# Altium schematic sheet HDLab.SchDoc
size 533 x 584 mm
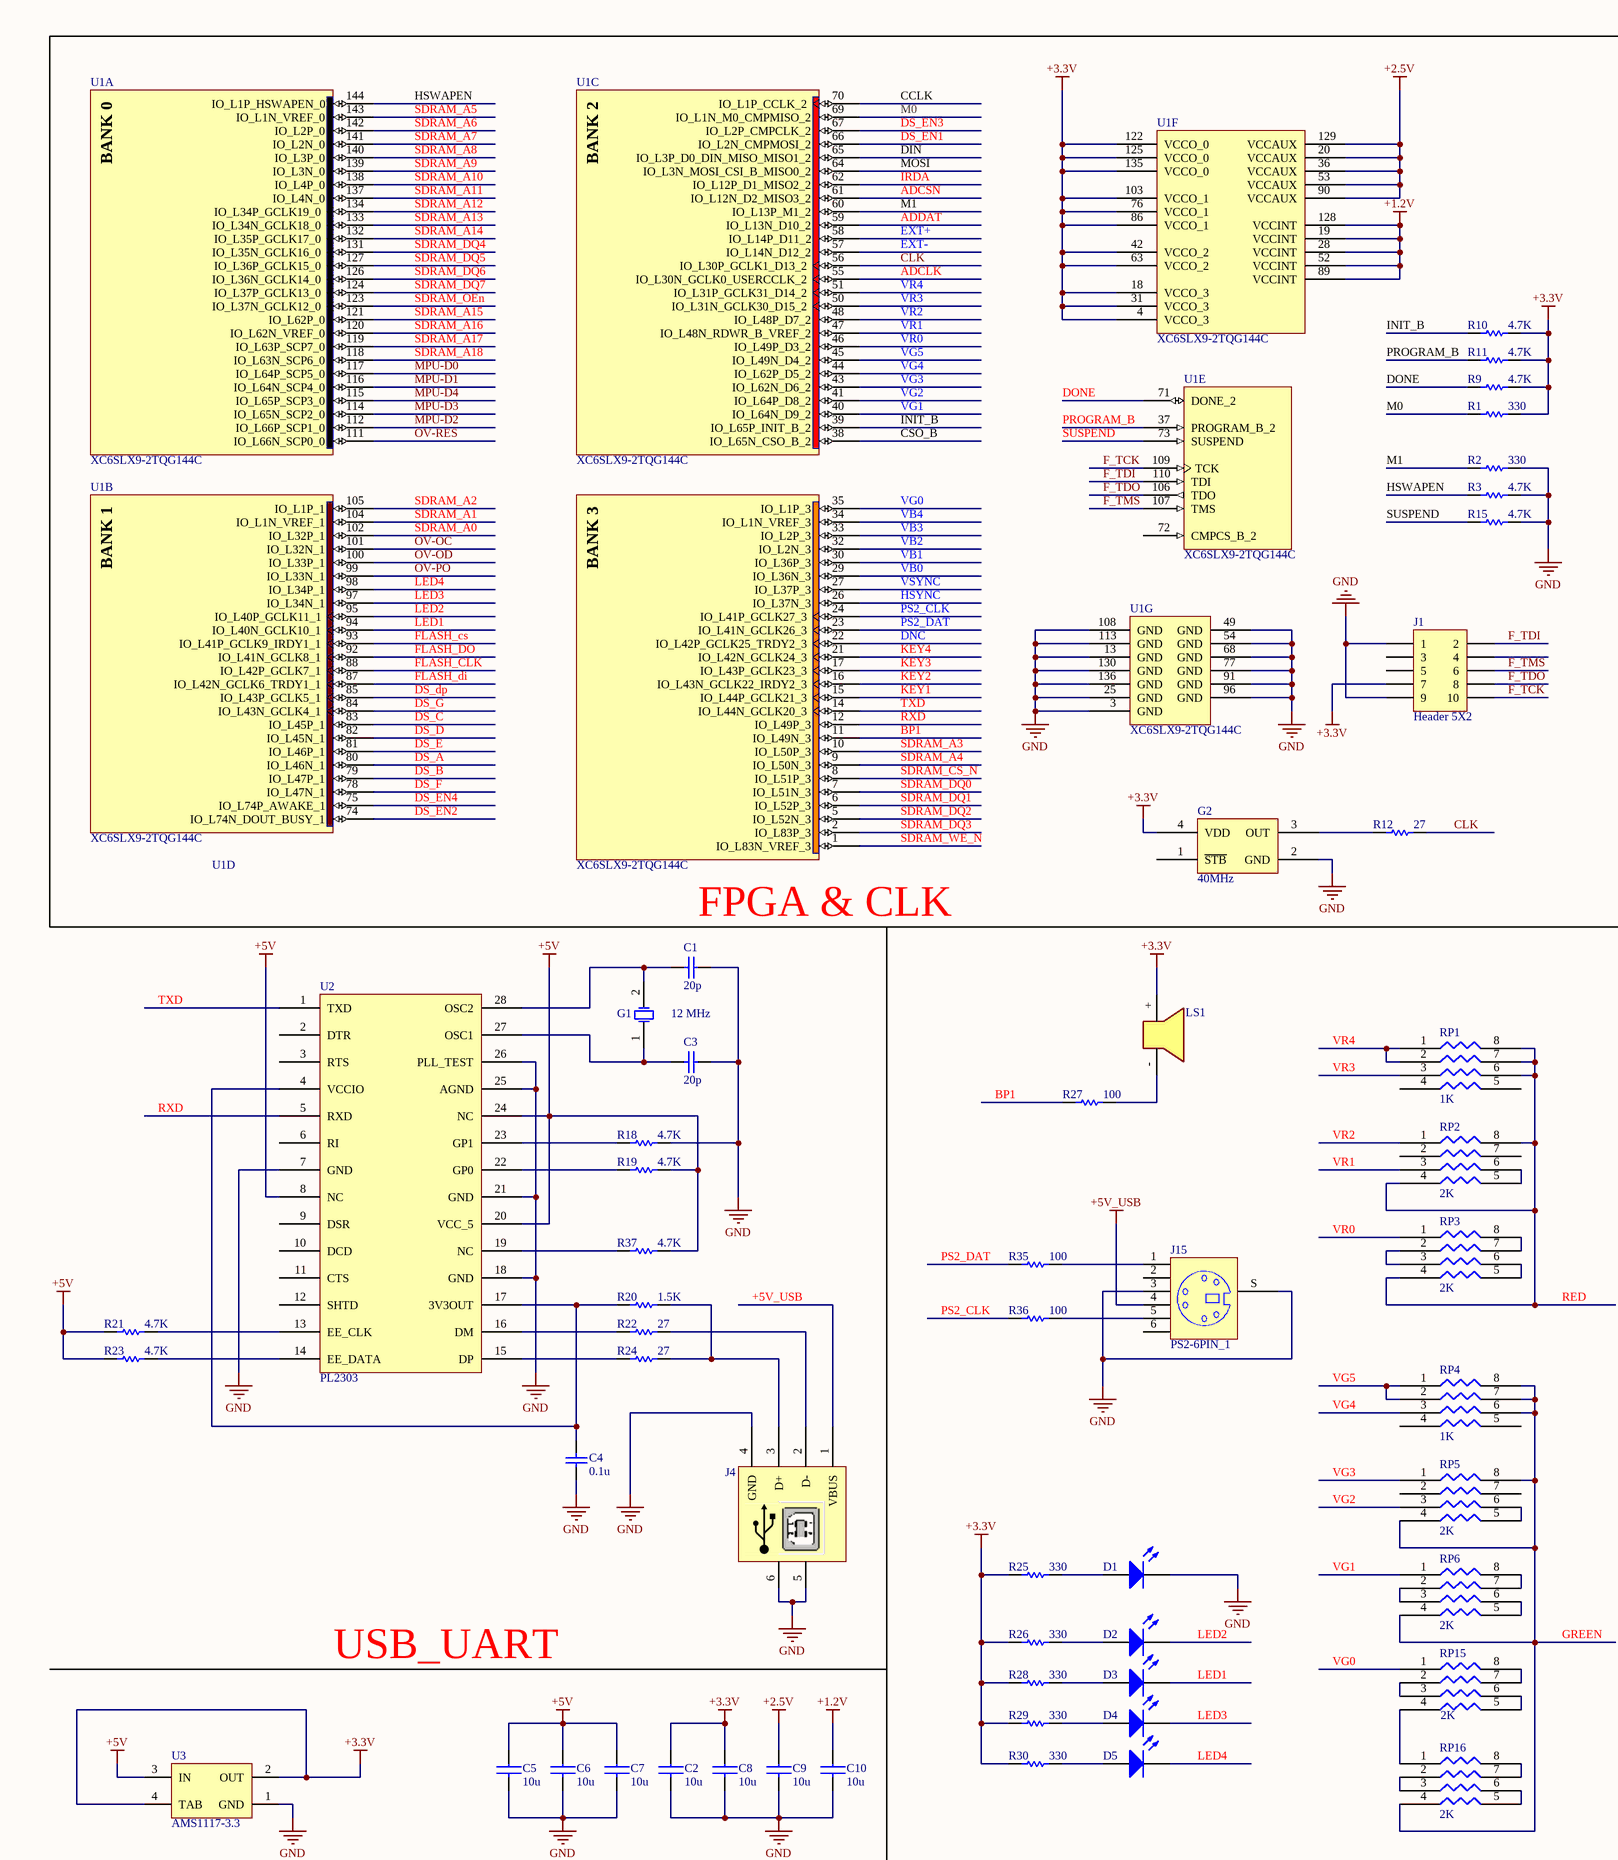
[diagram p0: HDLab.SchDoc, top left]
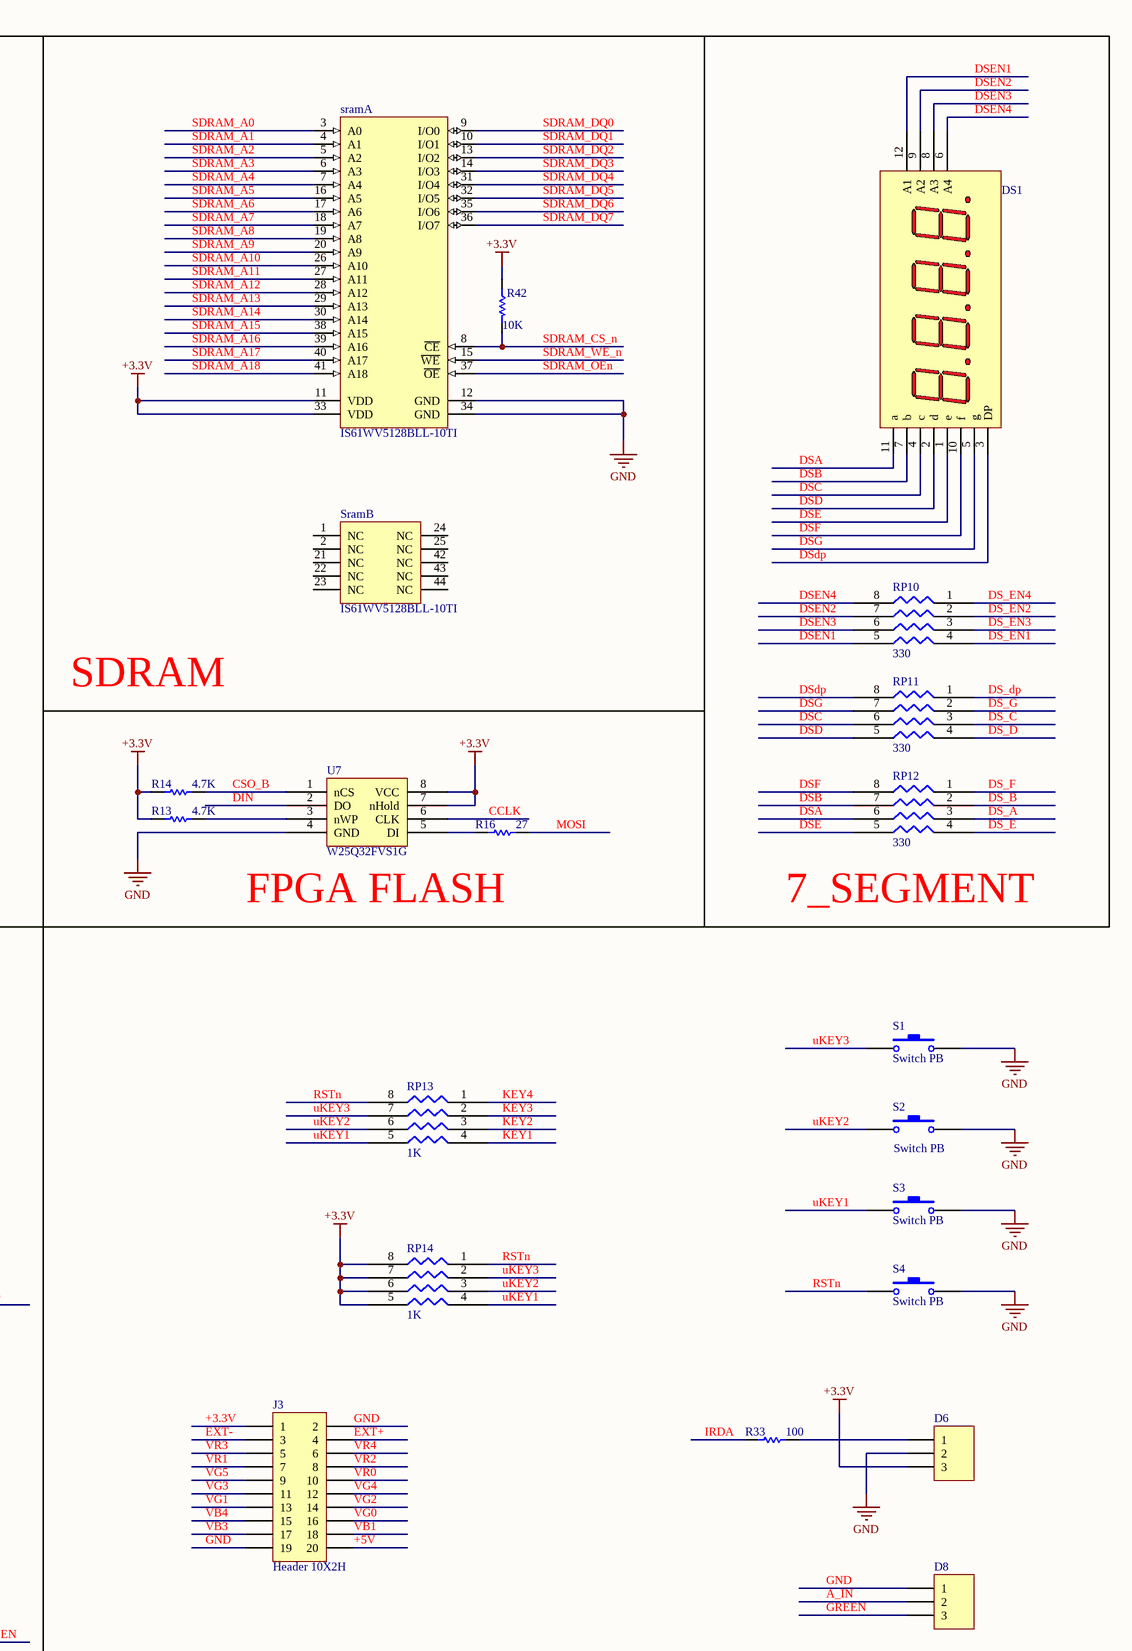
[diagram p1: HDLab.SchDoc, top right]
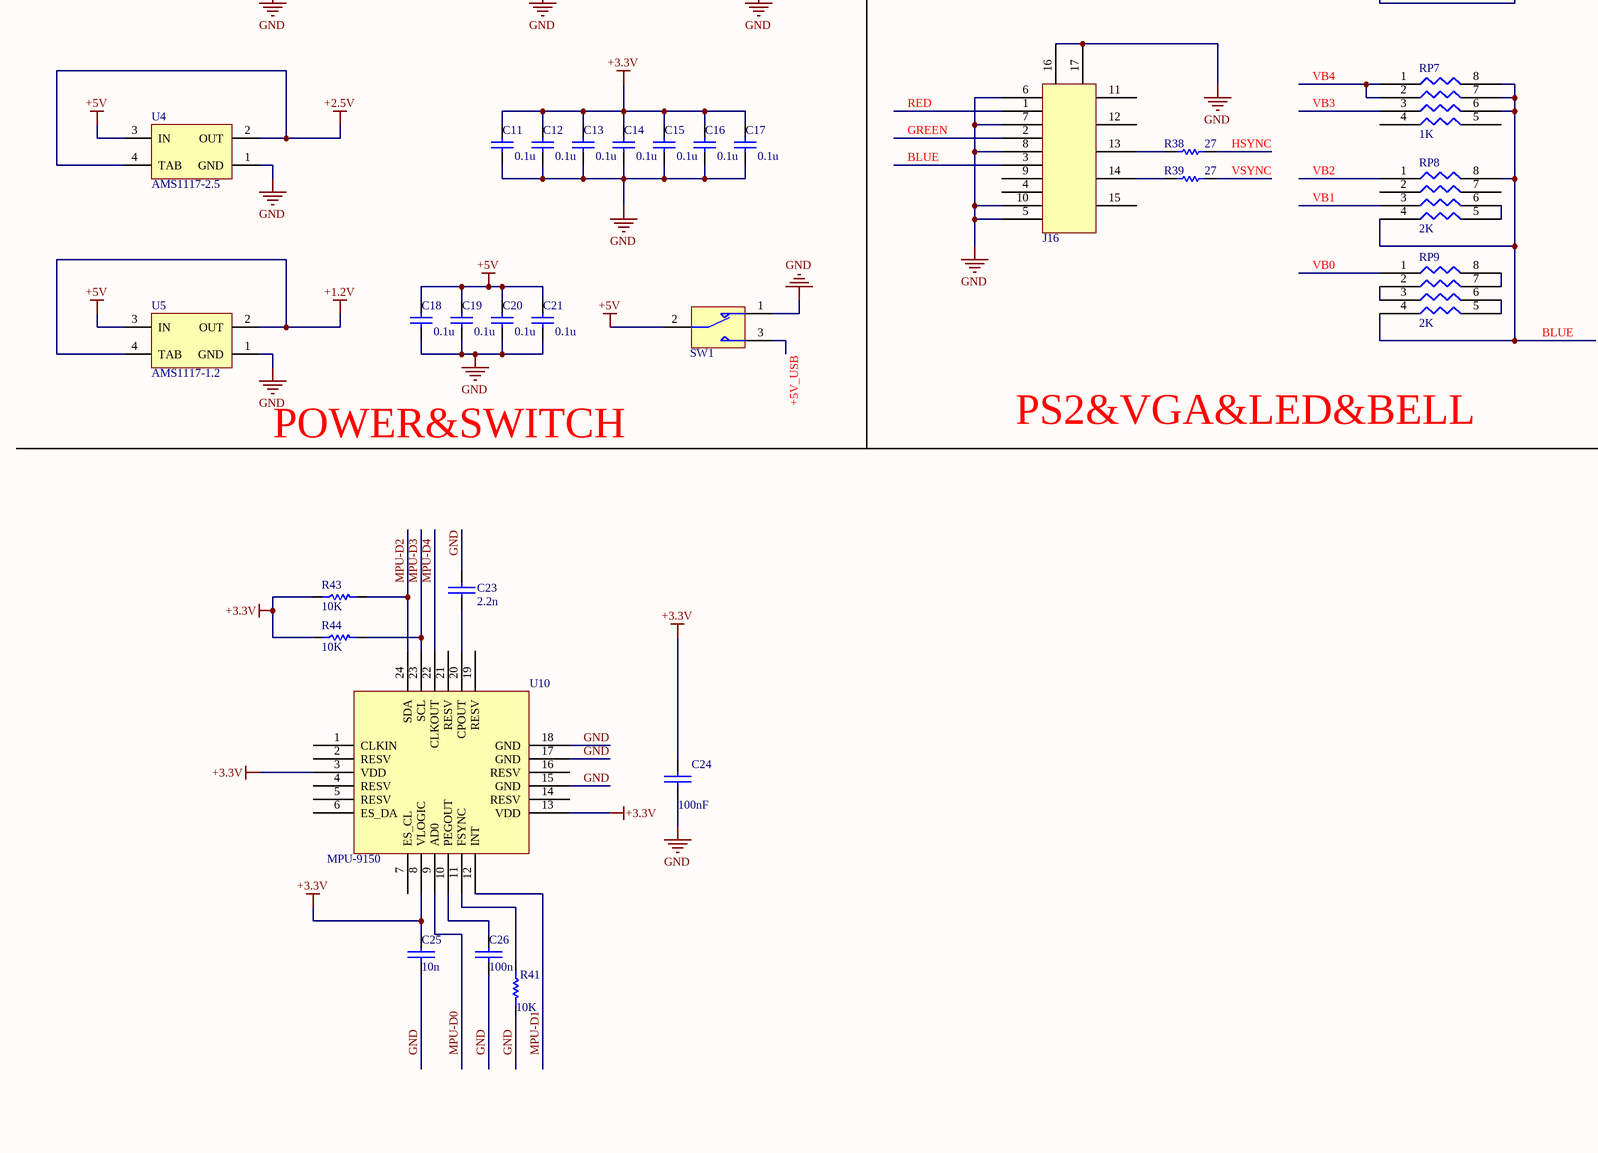
[diagram p2: HDLab.SchDoc, bottom left]
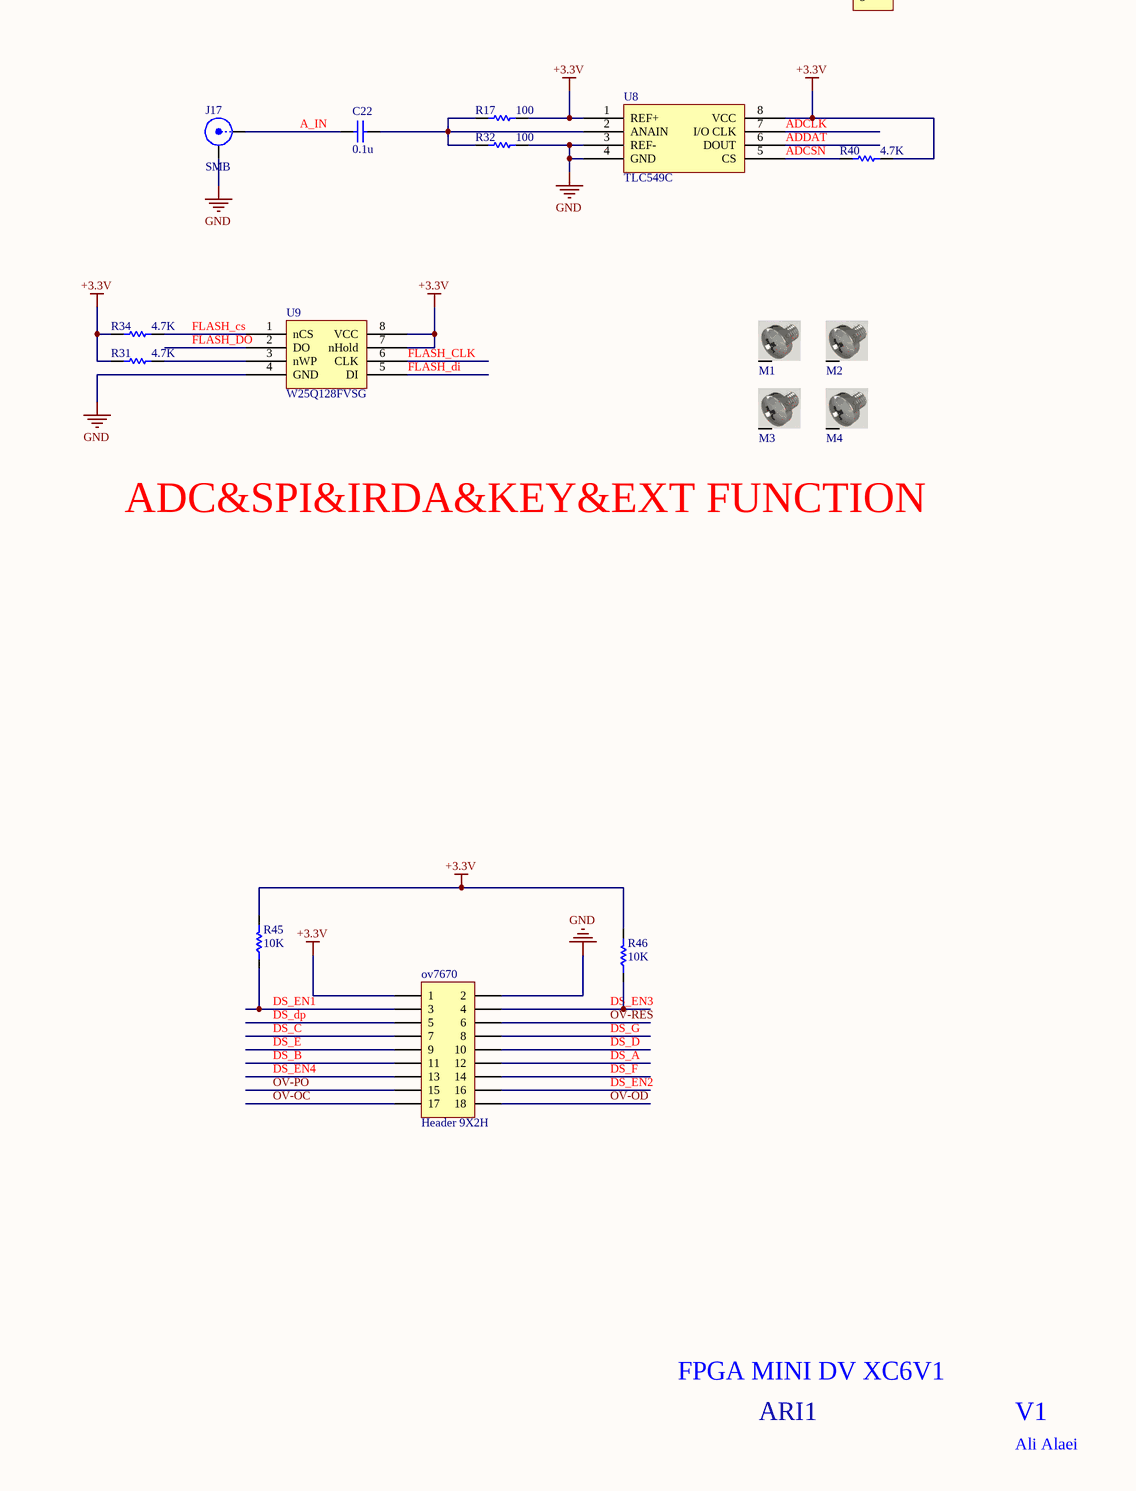
[diagram p3: HDLab.SchDoc, bottom right]

## Parts
C1  value 20p  [C0603]  (hidden comment: Cap Semi)
C2  10u  [C0805]
C3  value 20p  [C0603]  (hidden comment: Cap Semi)
C4  value 0.1u  [C0603]  (hidden comment: Cap Semi)
C5  10u  [C0805]
C6  10u  [C0805]
C7  10u  [C0805]
C8  10u  [C0805]
C9  10u  [C0805]
C10  10u  [C0805]
C11  value 0.1u  [C0603]  (hidden comment: Cap Semi)
C12  value 0.1u  [C0603]  (hidden comment: Cap Semi)
C13  value 0.1u  [C0603]  (hidden comment: Cap Semi)
C14  value 0.1u  [C0603]  (hidden comment: Cap Semi)
C15  value 0.1u  [C0603]  (hidden comment: Cap Semi)
C16  value 0.1u  [C0603]  (hidden comment: Cap Semi)
C17  value 0.1u  [C0603]  (hidden comment: Cap Semi)
C18  value 0.1u  [C0603]  (hidden comment: Cap Semi)
C19  value 0.1u  [C0603]  (hidden comment: Cap Semi)
C20  value 0.1u  [C0603]  (hidden comment: Cap Semi)
C21  value 0.1u  [C0603]  (hidden comment: Cap Semi)
C22  value 0.1u  [C0603]  (hidden comment: Cap Semi)
C23  2.2n  [SMD_CAP_0603]
C24  100nF  [SMD_CAP_0603]
C25  10n  [SMD_CAP_0603]
C26  100n  [SMD_CAP_0603]
D1  LED2  [LED_0603]  (value not drawn)
D2  LED2  [LED_0603]  (value not drawn)
D3  LED2  [LED_0603]  (value not drawn)
D4  LED2  [LED_0603]  (value not drawn)
D5  LED2  [LED_0603]  (value not drawn)
D6  Header 3  [My_1X03]  (value not drawn)
D8  Header 3  [jumper selector]  (value not drawn)
DS1  7Segment-4Digit-CA  [7seg]  (value not drawn)
G1  12 MHz  [XTAL Small]
G2  40MHz  [CSL]
J1  Header 5X2  [HDR2X5]
J3  Header 10X2H  [HDR2X10H]
J4  USB Connector  [USB2.5-2H4F]  (value not drawn)
J15  PS2-6PIN_1  [PS21]
J16  Component_1  [DE15]  (value not drawn)
J17  SMB  [SMB_V-RJ45]
LS1  Buzzer small  [My_Buzzer]  (value not drawn)
M1  Screw  [Board Screw_No Silk]  (value not drawn)
M2  Screw  [Board Screw_No Silk]  (value not drawn)
M3  Screw  [Board Screw_No Silk]  (value not drawn)
M4  Screw  [Board Screw_No Silk]  (value not drawn)
ov7670  Header 9X2H  [HDR2X9H]
R1  value 330  [R0603]  (hidden comment: Res1)
R2  value 330  [R0603]  (hidden comment: Res1)
R3  value 4.7K  [R0603]  (hidden comment: Res1)
R9  value 4.7K  [R0603]  (hidden comment: Res1)
R10  value 4.7K  [R0603]  (hidden comment: Res1)
R11  value 4.7K  [R0603]  (hidden comment: Res1)
R12  value 27  [R0603]  (hidden comment: Res1)
R13  value 4.7K  [R0603]  (hidden comment: Res1)
R14  value 4.7K  [R0603]  (hidden comment: Res1)
R15  value 4.7K  [R0603]  (hidden comment: Res1)
R16  value 27  [R0603]  (hidden comment: Res1)
R17  value 100  [R0603]  (hidden comment: Res1)
R18  value 4.7K  [R0603]  (hidden comment: Res1)
R19  value 4.7K  [R0603]  (hidden comment: Res1)
R20  value 1.5K  [R0603]  (hidden comment: Res1)
R21  value 4.7K  [R0603]  (hidden comment: Res1)
R22  value 27  [R0603]  (hidden comment: Res1)
R23  value 4.7K  [R0603]  (hidden comment: Res1)
R24  value 27  [R0603]  (hidden comment: Res1)
R25  value 330  [R0603]  (hidden comment: Res1)
R26  value 330  [R0603]  (hidden comment: Res1)
R27  value 100  [R0603]  (hidden comment: Res1)
R28  value 330  [R0603]  (hidden comment: Res1)
R29  value 330  [R0603]  (hidden comment: Res1)
R30  value 330  [R0603]  (hidden comment: Res1)
R31  value 4.7K  [R0603]  (hidden comment: Res1)
R32  value 100  [R0603]  (hidden comment: Res1)
R33  value 100  [R0603]  (hidden comment: Res1)
R34  value 4.7K  [R0603]  (hidden comment: Res1)
R35  value 100  [R0603]  (hidden comment: Res1)
R36  value 100  [R0603]  (hidden comment: Res1)
R37  value 4.7K  [R0603]  (hidden comment: Res1)
R38  value 27  [R0603]  (hidden comment: Res1)
R39  value 27  [R0603]  (hidden comment: Res1)
R40  value 4.7K  [R0603]  (hidden comment: Res1)
R41  10K  [RES 0603 (1608X06L)]
R42  10K  [RES 0603 (1608X06L)]
R43  10K  [RES 0603 (1608X06L)]
R44  10K  [RES 0603 (1608X06L)]
R45  10K  [RES 0603 (1608X06L)]
R46  10K  [RES 0603 (1608X06L)]
RP1  1K  [R4]
RP2  2K  [R4]
RP3  2K  [R4]
RP4  1K  [R4]
RP5  2K  [R4]
RP6  2K  [R4]
RP7  1K  [R4]
RP8  2K  [R4]
RP9  2K  [R4]
RP10  330  [R4]
RP11  330  [R4]
RP12  330  [R4]
RP13  1K  [R4]
RP14  1K  [R4]
RP15  2K  [R4]
RP16  2K  [R4]
S1  Switch PB  [Switch - Push to On]
S2  Switch PB  [Switch - Push to On]
S3  Switch PB  [Switch - Push to On]
S4  Switch PB  [Switch - Push to On]
sram  IS61WV5128BLL-10TI  [ISSI-TSOP-2-44_N]  (parts A,B of 2)
SW1  Switch SPDT_Subminiator  [SW]  (value not drawn)
U1  XC6SLX9-2TQG144C  [TQG144_N]  (parts A,B,C,D,E,F,G of 7)
U2  PL2303  [SSOP-SS28_N]
U3  AMS1117-3.3  [MP04A_N]
U4  AMS1117-2.5  [MP04A_N]
U5  AMS1117-1.2  [MP04A_N]
U7  W25Q32FVS1G  [sop8]
U8  TLC549C  [SOP8]
U9  W25Q128FVSG  [sop8]
U10  MPU-9150  [klklkl]

## Nets
+1.2V: C10.1 U1.19(VCCINT) U1.28(VCCINT) U1.52(VCCINT) U1.89(VCCINT) U1.128(VCCINT) U5.2(OUT) U5.4(TAB)
+2.5V: C9.1 U1.20(VCCAUX) U1.36(VCCAUX) U1.53(VCCAUX) U1.90(VCCAUX) U1.129(VCCAUX) U4.2(OUT) U4.4(TAB)
+3.3V: C2.1 C8.1 C11.1 C12.1 C13.1 C14.1 C15.1 C16.1 C17.1 C24.1(+) C25.2(-) D6.3 G2.4(VDD) J1.7 J3.1 LS1.+ ov7670.1 R1.2 R9.2 R10.2 R11.2 R13.1 R14.1 R17.2 R25.1 R26.1 R28.1 R29.1 R30.1 R31.1 R34.1 R40.2 R42.1 R43.1 R44.1 R45.2 R46.2 RP14.5 RP14.6 RP14.7 RP14.8 sram.11(VDD) sram.33(VDD) U1.4(VCCO_3) U1.18(VCCO_3) U1.31(VCCO_3) U1.42(VCCO_2) U1.63(VCCO_2) U1.76(VCCO_1) U1.86(VCCO_1) U1.103(VCCO_1) U1.122(VCCO_0) U1.125(VCCO_0) U1.135(VCCO_0) U3.2(OUT) U3.4(TAB) U7.7(nHold) U7.8(VCC) U8.1(REF+) U8.8(VCC) U9.7(nHold) U9.8(VCC) U10.3(VDD) U10.8(VLOGIC) U10.13(VDD)
+5V: C5.1 C6.1 C7.1 C18.1 C19.1 C20.1 C21.1 J3.20 R19.2 R21.1 R23.1 R37.2 SW1.2 U2.8(NC) U2.20(VCC_5) U2.24(NC) U3.3(IN) U4.3(IN) U5.3(IN)
+5V_USB: J4.1(VBUS) J15.4 SW1.3
GND: C1.1 C2.2 C3.1 C4.1 C5.2 C6.2 C7.2 C8.2 C9.2 C10.2 C11.2 C12.2 C13.2 C14.2 C15.2 C16.2 C17.2 C18.2 C19.2 C20.2 C21.2 C23.1(+) C24.2(-) C25.1(+) C26.1(+) D1.2(K) D6.2 D8.1 G2.2(GND) J1.1 J1.9 J3.2 J3.19 J4.4(GND) J4.5 J4.6 J15.3 J15.S J16.5 J16.6 J16.7 J16.8 J16.10 J16.16 J16.17 J17.2(Y) ov7670.2 R2.2 R3.2 R15.2 R18.2 R32.2 R41.2 S1.2 S2.2 S3.2 S4.2 sram.12(GND) sram.34(GND) SW1.1 U1.3(GND) U1.13(GND) U1.25(GND) U1.49(GND) U1.54(GND) U1.68(GND) U1.77(GND) U1.91(GND) U1.96(GND) U1.108(GND) U1.113(GND) U1.130(GND) U1.136(GND) U2.7(GND) U2.18(GND) U2.21(GND) U2.25(AGND) U2.26(PLL_TEST) U3.1(GND) U4.1(GND) U5.1(GND) U7.4(GND) U8.3(REF-) U8.4(GND) U9.4(GND) U10.15(GND) U10.17(GND) U10.18(GND)
A_IN: C22.1 D8.2 J17.1(X)
ADCLK: U1.55(IO_L30N_GCLK0_USERCCLK_2) U8.7(I/O_CLK)
ADCSN: R40.1 U1.61(IO_L12N_D2_MISO3_2) U8.5(CS)
ADDAT: U1.59(IO_L13N_D10_2) U8.6(DOUT)
BLUE: J16.3 RP7.6 RP7.7 RP7.8 RP8.4 RP8.8 RP9.4
BP1: R27.1 U1.11(IO_L49N_3)
CCLK: U1.70(IO_L1P_CCLK_2) U7.6(CLK)
CLK: R12.2 U1.56(IO_L30P_GCLK1_D13_2)
CSO_B: R14.2 U1.38(IO_L65N_CSO_B_2) U7.1(nCS)
DIN: U1.65(IO_L3P_D0_DIN_MISO_MISO1_2) U7.2(DO)
DNC: U1.22(IO_L42P_GCLK25_TRDY2_3)
DONE: R9.1 U1.71(DONE_2)
DS_A: ov7670.12 RP12.3 U1.80(IO_L46N_1)
DS_B: ov7670.11 RP12.2 U1.79(IO_L47P_1)
DS_C: ov7670.7 RP11.3 U1.83(IO_L45P_1)
DS_D: ov7670.10 RP11.4 U1.82(IO_L45N_1)
DS_dp: ov7670.5 RP11.1 U1.85(IO_L43P_GCLK5_1)
DS_E: ov7670.9 RP12.4 U1.81(IO_L46P_1)
DS_EN1: ov7670.3 R45.1 RP10.4 U1.66(IO_L2N_CMPMOSI_2)
DS_EN2: ov7670.16 RP10.2 U1.74(IO_L74N_DOUT_BUSY_1)
DS_EN3: ov7670.4 R46.1 RP10.3 U1.67(IO_L2P_CMPCLK_2)
DS_EN4: ov7670.13 RP10.1 U1.75(IO_L74P_AWAKE_1)
DS_F: ov7670.14 RP12.1 U1.78(IO_L47N_1)
DS_G: ov7670.8 RP11.2 U1.84(IO_L43N_GCLK4_1)
DSA: DS1.11(a) RP12.6
DSB: DS1.7(b) RP12.7
DSC: DS1.4(c) RP11.6
DSD: DS1.2(d) RP11.5
DSdp: DS1.3(DP) RP11.8
DSE: DS1.1(e) RP12.5
DSEN1: DS1.12(A1) RP10.5
DSEN2: DS1.9(A2) RP10.7
DSEN3: DS1.8(A3) RP10.6
DSEN4: DS1.6(A4) RP10.8
DSF: DS1.10(f) RP12.8
DSG: DS1.5(g) RP11.7
EXT+: J3.4 U1.58(IO_L14P_D11_2)
EXT-: J3.3 U1.57(IO_L14N_D12_2)
F_TCK: J1.10 U1.109(TCK)
F_TDI: J1.2 U1.110(TDI)
F_TDO: J1.8 U1.106(TDO)
F_TMS: J1.6 U1.107(TMS)
FLASH_CLK: U1.88(IO_L42P_GCLK7_1) U9.6(CLK)
FLASH_cs: R34.2 U1.93(IO_L41P_GCLK9_IRDY1_1) U9.1(nCS)
FLASH_di: U1.87(IO_L42N_GCLK6_TRDY1_1) U9.5(DI)
FLASH_DO: U1.92(IO_L41N_GCLK8_1) U9.2(DO)
GREEN: D8.3 J16.2 RP4.6 RP4.7 RP4.8 RP5.4 RP5.8 RP6.4 RP16.4
HSWAPEN: R3.1 U1.144(IO_L1P_HSWAPEN_0)
HSYNC: R38.2 U1.26(IO_L37N_3)
INIT_B: R10.1 U1.39(IO_L65P_INIT_B_2)
IRDA: R33.1 U1.62(IO_L12P_D1_MISO2_2)
KEY1: RP13.4 U1.15(IO_L44P_GCLK21_3)
KEY2: RP13.3 U1.16(IO_L43N_GCLK22_IRDY2_3)
KEY3: RP13.2 U1.17(IO_L43P_GCLK23_3)
KEY4: RP13.1 U1.21(IO_L42N_GCLK24_3)
LED1: D3.2(K) U1.94(IO_L40N_GCLK10_1)
LED2: D2.2(K) U1.95(IO_L40P_GCLK11_1)
LED3: D4.2(K) U1.97(IO_L34N_1)
LED4: D5.2(K) U1.98(IO_L34P_1)
M0: R1.1 U1.69(IO_L1N_M0_CMPMISO_2)
M1: R2.1 U1.60(IO_L13P_M1_2)
MOSI: R16.2 U1.64(IO_L3N_MOSI_CSI_B_MISO0_2)
MPU-D0: U1.117(IO_L64P_SCP5_0) U10.9(AD0)
MPU-D1: U1.116(IO_L64N_SCP4_0) U10.12(INT)
MPU-D2: R43.2 U1.112(IO_L66P_SCP1_0) U10.24(SDA)
MPU-D3: R44.2 U1.114(IO_L65N_SCP2_0) U10.23(SCL)
MPU-D4: U1.115(IO_L65P_SCP3_0) U10.22(CLKOUT)
OV-OC: ov7670.17 U1.101(IO_L32N_1)
OV-OD: ov7670.18 U1.100(IO_L33P_1)
OV-PO: ov7670.15 U1.99(IO_L33N_1)
OV-RES: ov7670.6 U1.111(IO_L66N_SCP0_0)
PROGRAM_B: R11.1 U1.37(PROGRAM_B_2)
PS2_CLK: R36.1 U1.24(IO_L41P_GCLK27_3)
PS2_DAT: R35.1 U1.23(IO_L41N_GCLK26_3)
RED: J16.1 RP1.6 RP1.7 RP1.8 RP2.4 RP2.8 RP3.4
RSTn: RP13.8 RP14.1 S4.1
RXD: U1.12(IO_L49P_3) U2.5(RXD)
SDRAM_A0: sram.3(A0) U1.102(IO_L32P_1)
SDRAM_A1: sram.4(A1) U1.104(IO_L1N_VREF_1)
SDRAM_A2: sram.5(A2) U1.105(IO_L1P_1)
SDRAM_A3: sram.6(A3) U1.10(IO_L50P_3)
SDRAM_A4: sram.7(A4) U1.9(IO_L50N_3)
SDRAM_A5: sram.16(A5) U1.143(IO_L1N_VREF_0)
SDRAM_A6: sram.17(A6) U1.142(IO_L2P_0)
SDRAM_A7: sram.18(A7) U1.141(IO_L2N_0)
SDRAM_A8: sram.19(A8) U1.140(IO_L3P_0)
SDRAM_A9: sram.20(A9) U1.139(IO_L3N_0)
SDRAM_A10: sram.26(A10) U1.138(IO_L4P_0)
SDRAM_A11: sram.27(A11) U1.137(IO_L4N_0)
SDRAM_A12: sram.28(A12) U1.134(IO_L34P_GCLK19_0)
SDRAM_A13: sram.29(A13) U1.133(IO_L34N_GCLK18_0)
SDRAM_A14: sram.30(A14) U1.132(IO_L35P_GCLK17_0)
SDRAM_A15: sram.38(A15) U1.121(IO_L62P_0)
SDRAM_A16: sram.39(A16) U1.120(IO_L62N_VREF_0)
SDRAM_A17: sram.40(A17) U1.119(IO_L63P_SCP7_0)
SDRAM_A18: sram.41(A18) U1.118(IO_L63N_SCP6_0)
SDRAM_CS_N: R42.2 sram.8(~{CE}) U1.8(IO_L51P_3)
SDRAM_DQ0: sram.9(I/O0) U1.7(IO_L51N_3)
SDRAM_DQ1: sram.10(I/O1) U1.6(IO_L52P_3)
SDRAM_DQ2: sram.13(I/O2) U1.5(IO_L52N_3)
SDRAM_DQ3: sram.14(I/O3) U1.2(IO_L83P_3)
SDRAM_DQ4: sram.31(I/O4) U1.131(IO_L35N_GCLK16_0)
SDRAM_DQ5: sram.32(I/O5) U1.127(IO_L36P_GCLK15_0)
SDRAM_DQ6: sram.35(I/O6) U1.126(IO_L36N_GCLK14_0)
SDRAM_DQ7: sram.36(I/O7) U1.124(IO_L37P_GCLK13_0)
SDRAM_OEn: sram.37(~{OE}) U1.123(IO_L37N_GCLK12_0)
SDRAM_WE_N: sram.15(~{WE}) U1.1(IO_L83N_VREF_3)
SUSPEND: R15.1 U1.73(SUSPEND)
TXD: U1.14(IO_L44N_GCLK20_3) U2.1(TXD)
uKEY1: RP13.5 RP14.4 S3.1
uKEY2: RP13.6 RP14.3 S2.1
uKEY3: RP13.7 RP14.2 S1.1
VB0: RP9.1 U1.29(IO_L36N_3)
VB1: J3.18 RP8.3 U1.30(IO_L36P_3)
VB2: RP8.1 U1.32(IO_L2N_3)
VB3: J3.17 RP7.3 U1.33(IO_L2P_3)
VB4: J3.15 RP7.1 RP7.2 U1.34(IO_L1N_VREF_3)
VG0: J3.16 RP15.1 U1.35(IO_L1P_3)
VG1: J3.13 RP6.1 U1.40(IO_L64N_D9_2)
VG2: J3.14 RP5.3 U1.41(IO_L64P_D8_2)
VG3: J3.11 RP5.1 U1.43(IO_L62N_D6_2)
VG4: J3.12 RP4.3 U1.44(IO_L62P_D5_2)
VG5: J3.9 RP4.1 RP4.2 U1.45(IO_L49N_D4_2)
VR0: J3.10 RP3.1 U1.46(IO_L49P_D3_2)
VR1: J3.7 RP2.3 U1.47(IO_L48N_RDWR_B_VREF_2)
VR2: J3.8 RP2.1 U1.48(IO_L48P_D7_2)
VR3: J3.5 RP1.3 U1.50(IO_L31N_GCLK30_D15_2)
VR4: J3.6 RP1.1 RP1.2 U1.51(IO_L31P_GCLK31_D14_2)
VSYNC: R39.2 U1.27(IO_L37P_3)
NetC1_2: C1.2 G1.2(OSC2) U2.28(OSC2)
NetC3_2: C3.2 G1.1(OSC1) U2.27(OSC1)
NetC4_2: C4.2 R20.1 U2.4(VCCIO) U2.17(3V3OUT)
NetC22_2: C22.2 R17.1 R32.1 U8.2(ANAIN)
NetC23_2: C23.2(-) U10.20(CPOUT)
NetC26_2: C26.2(-) U10.10(PEGOUT)
NetD1_1: D1.1(A) R25.2
NetD2_1: D2.1(A) R26.2
NetD3_1: D3.1(A) R28.2
NetD4_1: D4.1(A) R29.2
NetD5_1: D5.1(A) R30.2
NetD6_1: D6.1 R33.2
NetG2_3: G2.3(OUT) R12.1
NetJ4_2: J4.2(D-) R22.2
NetJ4_3: J4.3(D+) R20.2 R24.2
NetJ15_1: J15.1 R35.2
NetJ15_5: J15.5 R36.2
NetJ16_13: J16.13 R38.1
NetJ16_14: J16.14 R39.1
NetLS1_-: LS1.- R27.2
NetR13_2: R13.2 U7.3(nWP)
NetR16_1: R16.1 U7.5(DI)
NetR18_1: R18.1 U2.23(GP1)
NetR19_1: R19.1 U2.22(GP0)
NetR21_2: R21.2 U2.13(EE_CLK)
NetR22_1: R22.1 U2.16(DM)
NetR23_2: R23.2 U2.14(EE_DATA)
NetR24_1: R24.1 U2.15(DP)
NetR31_2: R31.2 U9.3(nWP)
NetR37_1: R37.1 U2.19(NC)
NetR41_1: R41.1 U10.11(FSYNC)
NetRP2_5: RP2.5 RP2.6
NetRP3_2: RP3.2 RP3.3
NetRP3_5: RP3.5 RP3.6
NetRP3_7: RP3.7 RP3.8
NetRP5_5: RP5.5 RP5.6
NetRP6_2: RP6.2 RP6.3
NetRP6_5: RP6.5 RP6.6
NetRP6_7: RP6.7 RP6.8
NetRP8_5: RP8.5 RP8.6
NetRP9_2: RP9.2 RP9.3
NetRP9_5: RP9.5 RP9.6
NetRP9_7: RP9.7 RP9.8
NetRP15_2: RP15.2 RP15.3
NetRP15_4: RP15.4 RP16.1
NetRP15_5: RP15.5 RP15.6
NetRP15_7: RP15.7 RP15.8
NetRP16_2: RP16.2 RP16.3
NetRP16_5: RP16.5 RP16.6
NetRP16_7: RP16.7 RP16.8

Not connected (* = marked no-connect by the designer): G2 1(~{STB}); J1 3 4 5; J15 2 6; J16 4 9 11 12 15; M1 S; M2 S; M3 S; M4 S; RP1 4 5; RP2 2 7; RP4 4 5; RP5 2 7; RP7 4 5; RP8 2 7; Sram 1(NC) 2(NC) 21(NC) 22(NC) 23(NC) 24(NC) 25(NC) 42(NC) 43(NC) 44(NC); U1 72(CMPCS_B_2); U2 2(DTR) 3(RTS) 6(RI) 9(DSR) 10(DCD) 11(CTS) 12(SHTD); U10 1(CLKIN) 2(RESV) 4(RESV) 5(RESV) 6(ES_DA) 7(ES_CL) 14(RESV) 16(RESV) 19(RESV) 21(RESV)

## Notes on the sheet
- SDRAM
- FPGA & CLK
- FPGA FLASH
- (near RP12) 7_SEGMENT
- USB_UART
- (near M3) ADC&SPI&IRDA&KEY&EXT FUNCTION
- POWER&SWITCH
- PS2&VGA&LED&BELL
- FPGA MINI DV XC6V1
- ARI1
- V1
- Ali Alaei
- (in symbol XC6SLX9-2TQG144C, part A) BANK 0
- (in symbol XC6SLX9-2TQG144C, part B) BANK 1
- (in symbol XC6SLX9-2TQG144C, part C) BANK 2
- (in symbol XC6SLX9-2TQG144C, part D) BANK 3

## Library data of the parts
C1 C3 C4 C11-C22 = Cap Semi: Capacitor (Semiconductor SIM Model); Published: 8-Jun-2000; LatestRevisionDate: 29-May-2009; LatestRevisionNote: IPC-7351 Footprint Added.; PackageReference: C1206; Publisher: Altium Limited; PackageDescription: Chip Capacitor
C2 C5-C10 = GRM21BR71H105KA12L: CAP CER 1UF 50V X7R 0805; Manufacturer: Murata Electronics North America; Capacitance: 1.0µF; .Checked PCB: used; Tolerance: ±10%; Category: Capacitors; Manufacturer Part Number: GRM21BR71H105KA12L; Operating Temperature: -55°C ~ 125°C; Package / Case: 0805 (2012 Metric); Price 1k [$]: 0.1359; Value: 1uF; .Checked SCH: used; Voltage - Rated: 50V; Supplier Part Number: 490-4736-1-ND; Supplier: Digikey; Supplier 1: Digi-Key; Supplier Part Number 1: 490-4736-1-ND; RoHS: RoHS Compliant; Stock 1: 422791; Pricing 1: 1=0.28, 10=0.254, 25=0.226, 50=0.1978, 100=0.1836, 250=0.16952, 500=0.16102, 750=0.14691, 1000=0.12995 (USD); Temperature Coefficient: X7R; Mounting Type: Surface Mount, MLCC; Applications: General Purpose; Ratings: -; Size / Dimension: 0.079" L x 0.049" W (2.00mm x 1.25mm); Height - Seated (Max): -; Thickness (Max): 0.053" (1.35mm); Lead Spacing: -; Features: -; Packaging: Cut Tape (CT); Lead Style: -; ComponentLink1URL: http://search.murata.co.jp/Ceramy/image/img/PDF/ENG/GRM21BR71H105KA12.pdf; ComponentLink1Description: http://search.murata.co.jp/Ceramy/image/img/PDF/ENG/GRM21BR71H105KA12.pdf
C23-C26 = Cap-Bipolar: Bipolar Capacitor; Voltage: 100V; Designer: Saeid Jorablo; Organazation: ControTec; Adding Date: 1387/12/20
  C23: Value: 2.2n
  C24: Value: 100nF
  C25: Value: 10n
  C26: Value: 100n
D1-D5 = LED2: Typical RED, GREEN, YELLOW, AMBER GaAs LED; Published: 8-Jun-2000; LatestRevisionDate: 17-Jul-2002; LatestRevisionNote: Re-released for DXP Platform.; PackageVersion: Feb-2002; PackageReference: 3.2X1.6X1.1; Publisher: Altium Limited; PackageDescription: SM LED; 2 Flat Leads
D6 D8 = Header 3: Header, 3-Pin; LatestRevisionDate: 17-Jul-2002; LatestRevisionNote: Re-released for DXP Platform.; Publisher: Altium Limited
DS1 = 7Seg-4Digit-CA: 7-Segment Display: CA; Colour: Read; Designer: Seyed Mohsen Ghasemain; Published: 07/31/2012; Publisher: www.picpars.com; ComponentLink1URL: http://www.picpars.com/
G1 = XTAL: XTAL Crystal; Company: E.P.I.L; Design Date: 11/04/2011; Value: 12 MHz
G2 = ASFLMB-12.288MHZ-LR-T: OSC 32SMX  40MHZ SMD; pin to pad: 1>3 2>4 3>1 4>2; Manufacturer: Abracon Corporation; Function: Standby (Power Down); Output: CMOS; Voltage - Supply: 1.8 V ~ 3.3 V; Frequency Stability: ±25ppm; Current - Supply (Max): 16mA; Current - Supply (Disable) (Max): 15µA; .Creator: MM; Supplier 1: Digi-Key; Manufacturer Part Number: ASFLMB-12.288MHZ-LR-T; RoHS: RoHS Compliant; Category: Crystals and Oscillators; Stock 1: 5427; Pricing 1: 1=2.81, 10=2.438, 50=2.1376, 100=1.6875, 500=1.425 (USD); Packaging: Cut Tape (CT); Type: MEMS (Silicon); Frequency: 12.288MHz; Operating Temperature: -40°C ~ 85°C; Ratings: -; Mounting Type: Surface Mount; Size / Dimension: 0.197" L x 0.126" W (5.00mm x 3.20mm); Height: 0.035" (0.90mm); Package / Case: 4-SMD, No Lead (DFN, LCC); ComponentLink1URL: http://www.abracon.com/memspeedpro/MEMSpeedProFlyerII.pdf; ComponentLink1Description: http://www.abracon.com/memspeedpro/MEMSpeedProFlyerII.pdf; Supplier Part Number 1: 535-10982-1-ND; .Checked PCB: MM; .Checked SCH: MM
J1 = Header 5X2: Header, 5-Pin, Dual row; LatestRevisionDate: 17-Jul-2002; LatestRevisionNote: Re-released for DXP Platform.; Publisher: Altium Limited
J3 = Header 10X2H: Header, 10-Pin, Dual row, Right Angle; LatestRevisionDate: 17-Jul-2002; LatestRevisionNote: Re-released for DXP Platform.; Publisher: Altium Limited
J4 = USB: USB Connector-B Type; Designer: Eng. Saeid Jorablo; Company: DASE Co; Adding Date: 10/26/2010
J15 = PS2-6PIN: 6 Pin Through Hole PS2 Socket (Kycon P/N); Published: 17-Dec-2003; Publisher: Altium Limited; ComponentLink1Description: Manufacturer Link; ComponentLink1URL: http://www.oupiin.com/prodindx.html#Headers
J17 = SMB: SMB Straight Connector; LatestRevisionDate: 17-Jul-2002; LatestRevisionNote: Re-released for DXP Platform.; Publisher: Altium Limited
LS1 = Buzzer: 5-12v small buzzer (12mm)
M1-M4 = Board Screw: Board Screw With Spacer
ov7670 = Header 9X2H: Header, 9-Pin, Dual row, Right Angle; LatestRevisionDate: 17-Jul-2002; LatestRevisionNote: Re-released for DXP Platform.; Publisher: Altium Limited
R1-R3 R9-R40 = Res1: Resistor; Published: 8-Jun-2000; LatestRevisionDate: 17-Jul-2002; LatestRevisionNote: Re-released for DXP Platform.; PackageReference: AXIAL-0.3; Publisher: Altium Limited; PackageDescription: Axial Device, Thru-Hole; 2 Leads; 0.3 in Pin Spacing
R41-R46 = Resistor: Value: 10K
RP1-RP16 U8 = Component_1
S1-S4 = Switch PB: Push Button Switch
sram = IS61WV5128BLL-10TI: 4 M High Speed Asynchronous CMOS SRAM, 512 K x 8, -40 to 85 degC, 44-Pin SOP (TSOP-2-44); Manufacturer: Integrated Silicon Solution Inc (ISSI); Density: 4M; Organization: 512K x 8; Packing: Tray / Tube; Speed (ns): 10; DatasheetVersion: Rev. I; PackageVersion: Rev. F, 06/2008; PackageReference: TSOP-2-44; PackageDescription: 44-Pin 400 mil TSOP-2, Body 18.41 x 10.16 mm, Pitch 0.8 mm; Mounting Technology: Surface Mount; PartNumber: IS61WV5128BLL-10TI; ComponentLink1Description: Manufacturer URL; ComponentLink1URL: http://www.issi.com/US/index.shtml; ComponentLink2Description: Datasheet; ComponentLink2URL: http://www.issi.com/WW/pdf/61-64WV5128Axx-Bxx.pdf; ComponentLink3Description: Package Specification; ComponentLink3URL: http://www.issi.com/WW/pdf/61-64WV6416EEBLL.pdf
SW1 = Switch SPDT_Subminiator: Subminiator SPDT Switch; Company: E.P.I.L; Design date: 2011/11/02
U1 = XC6SLX9-2TQG144C: Spartan-6 LX 1.2V FPGA, 102 User I/Os, 144-Pin TQFP (0.5mm Pitch), Speed Grade 2, Commercial Grade, Pb-Free; Published: 17-Nov-2009; DatasheetVersion: ver1.6, Nov-2010; PackageVersion: ver1.2, Jun-2004; PackageReference: TQG144; Publisher: Altium Limited; PackageDescription: 144-Pin Thin Quad Flat Pack (TQG144) - Pb-Free; Supplier 1: Digi-Key; Supplier Part Number 1: XC6SLX9-2TQG144C-ND; Code_JEDEC: MS-026-BFB; ComponentLink1Description: Manufacturer Link; ComponentLink1URL: http://www.xilinx.com; ComponentLink2Description: Spartan-6 Datasheet; ComponentLink2URL: http://www.xilinx.com/support/documentation/data_sheets/ds160.pdf; ComponentLink3Description: Spartan-6 Documents; ComponentLink3URL: http://www.xilinx.com/support/documentation/spartan-6.htm; ComponentLink4Description: Xilinx.com Home; ComponentLink4URL: http://www.xilinx.com
U3-U5 = LM1117IMP-x.x: x.x Volt, 800mA Low-Dropout Linear Regulator, 4-pin SOT-223; PartNumber: LM1117IMP-3.3; Manufacturer: National Semiconductor; PackageTopMarking: XYTT*N05B; PowerWise: N; CompType: LDO IC; Published: 4-Dec-2008; DatasheetVersion: Apr-2006; PackageVersion: revB, Apr-2003; PackageReference: MP04A; Publisher: Altium Limited; PackageDescription: Molded SOT-223, 6.50 x 3.56 x 1.6mm Body, 4 Lead, 2.3mm Pitch; Supplier 1: Farnell; Supplier Part Number 1: 7614123; RoHS: N; PinCount: 4; Code_JEDEC: TO-261-AA; Code_IPC: SOT223-4; ComponentLink1Description: LM1117 Datasheet; ComponentLink1URL: http://www.national.com/ds/LM/LM1117.pdf; ComponentLink2Description: LM1117 Web Page; ComponentLink2URL: http://www.national.com/pf/LM/LM1117.html; ComponentLink3Description: MP04A Package Page; ComponentLink3URL: http://www.national.com/packaging/folders/mp04a.html
U9 = W25Q32FVS1G